# Altium project BUS.PrjPcb
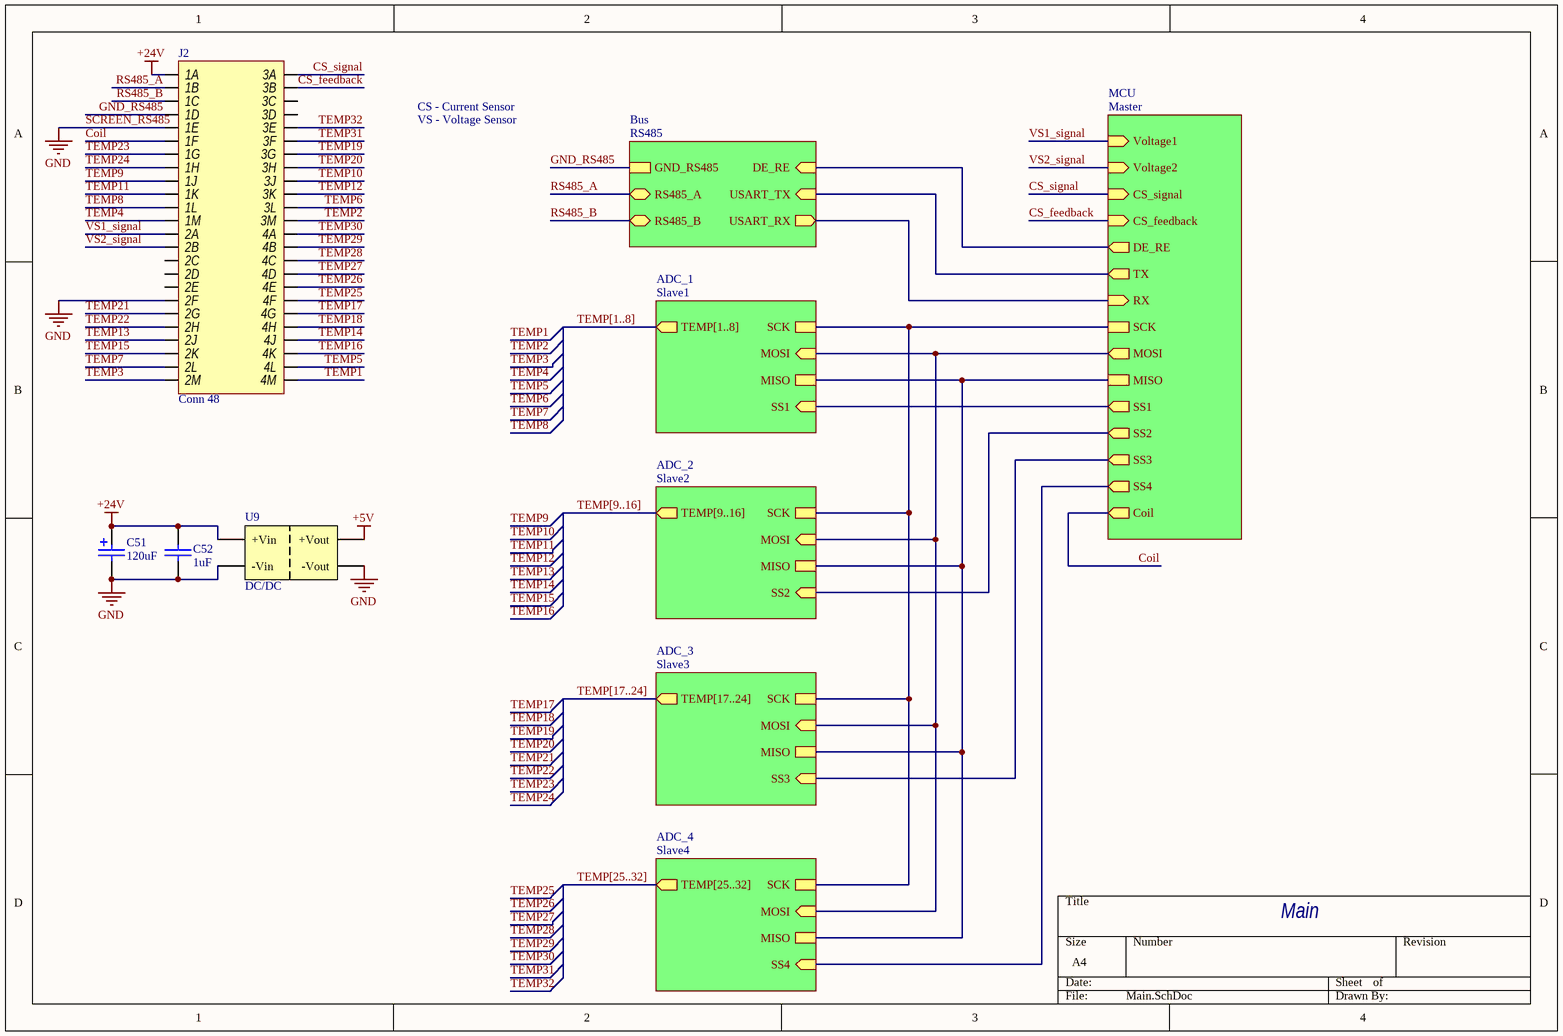
[diagram p0: Main.SchDoc]
7 sheets, 107 parts. Net scope: hierarchical (ports join the sheet entries above them; power ports are global).
Board file: BUS.PcbDoc
Sheets:
  Main.SchDoc
    MCU = Master.SchDoc
    ADC_2 = Slave2.SchDoc
    ADC_1 = Slave1.SchDoc
    ADC_4 = Slave4.SchDoc
    ADC_3 = Slave3.SchDoc
    Bus = RS485.SchDoc

## Sheet Main.SchDoc
size A4; SheetNumber: 1; SheetTotal: 7

### Parts
C51  120uF  [Bar Cap 8 mm]
C52  1uF  [0603 Capicator]
J2  Conn 48  [5007620481]
U9  DC/DC  [SIP7]

### Sub-sheets
ADC_1 = Slave1: TEMP[1..8] (out), MISO, SS1 (in), MOSI (in), SCK
ADC_2 = Slave2: TEMP[9..16] (out), MISO, SS2 (in), MOSI (in), SCK
ADC_3 = Slave3: TEMP[17..24] (out), MISO, SS3 (in), MOSI (in), SCK
ADC_4 = Slave4: TEMP[25..32] (out), MISO, SS4 (in), MOSI (in), SCK
Bus = RS485: USART_TX (in), USART_RX (out), RS485_A (bidir), RS485_B (bidir), DE_RE (in), GND_RS485
MCU = Master: MISO, SCK, SS1 (out), MOSI (out), SS2 (out), SS3 (out), SS4 (out), Coil (out), TX (out), RX (in), CS_feedback (in), CS_signal (in), DE_RE (out), Voltage2 (in), Voltage1 (in)

### Nets
+5V: U9.6(+Vout)
+24V: C51.2 C52.2 J2.1A U9.1(+Vin)
GND: C51.1 C52.1 J2.1E J2.2F U9.2(-Vin) U9.4(-Vout)
Coil: J2.1F ; sheet MCU/Coil
CS_feedback: J2.3B ; sheet MCU/CS_feedback
CS_signal: J2.3A ; sheet MCU/CS_signal
GND_RS485: J2.1D ; sheet Bus/GND_RS485
MISO: sheet MCU/MISO, sheet ADC_2/MISO, sheet ADC_1/MISO, sheet ADC_4/MISO, sheet ADC_3/MISO
MOSI: sheet MCU/MOSI, sheet ADC_2/MOSI, sheet ADC_1/MOSI, sheet ADC_4/MOSI, sheet ADC_3/MOSI
RS485_A: J2.1B ; sheet Bus/RS485_A
RS485_B: J2.1C ; sheet Bus/RS485_B
SCK: sheet MCU/SCK, sheet ADC_2/SCK, sheet ADC_1/SCK, sheet ADC_4/SCK, sheet ADC_3/SCK
TEMP1: J2.4M
TEMP2: J2.3M
TEMP3: J2.2M
TEMP4: J2.1M
TEMP5: J2.4L
TEMP6: J2.3L
TEMP7: J2.2L
TEMP8: J2.1L
TEMP9: J2.1J
TEMP10: J2.3J
TEMP11: J2.1K
TEMP12: J2.3K
TEMP13: J2.2J
TEMP14: J2.4J
TEMP15: J2.2K
TEMP16: J2.4K
TEMP17: J2.4G
TEMP18: J2.4H
TEMP19: J2.3G
TEMP20: J2.3H
TEMP21: J2.2G
TEMP22: J2.2H
TEMP23: J2.1G
TEMP24: J2.1H
TEMP25: J2.4F
TEMP26: J2.4E
TEMP27: J2.4D
TEMP28: J2.4C
TEMP29: J2.4B
TEMP30: J2.4A
TEMP31: J2.3F
TEMP32: J2.3E
VS1_signal: J2.2A ; sheet MCU/Voltage1
VS2_signal: J2.2B ; sheet MCU/Voltage2
NetU3_24: sheet MCU/SS4, sheet ADC_4/SS4
NetU3_25: sheet MCU/SS3, sheet ADC_3/SS3
NetU3_26: sheet MCU/SS2, sheet ADC_2/SS2
NetU3_27: sheet MCU/SS1, sheet ADC_1/SS1
NetU3_41: sheet MCU/DE_RE, sheet Bus/DE_RE
NetU3_42: sheet MCU/TX, sheet Bus/USART_TX
NetU3_43: sheet MCU/RX, sheet Bus/USART_RX

Not connected (* = marked no-connect by the designer): J2 2C 2D 2E 3C 3D

### Buses and harness runs
bus TEMP[1..8] = sheet ADC_1/TEMP[1..8]
bus TEMP[9..16] = sheet ADC_2/TEMP[9..16]
bus TEMP[17..24] = sheet ADC_3/TEMP[17..24]
bus TEMP[25..32] = sheet ADC_4/TEMP[25..32]

### Notes on the sheet
- CS - Current Sensor
- (near J2) SCREEN_RS485
- VS - Voltage Sensor
- Main

### Library data of the parts
C51 = Cap Pol 120uF: Polymer capacitor with low E.S.R. Rated voltage - 80V.; Manufacturer: Matsushita; PartNumber: EEU-FS1K121LB; Type: Capacitor; ComponentLink1Description: ChipDip; ComponentLink1URL: https://www.chipdip.ru/product0/8001968680
C52 = Cap 1uF (0603): 1uF X5R 25V 10% 0603; Manufacturer: Murata Manufacturing; Part Number: GRM188R61E105KAADD; Type: Capacitor; ComponentLink1Description: Chip&Dip; ComponentLink1URL: https://www.chipdip.ru/product/grm188r61e105k
J2 = Conn 48 (Molex): Molec 48 pin PCB Header 5007620481; Manufacturer: Molex; Type: Connector; Part Number: 5007620481; ComponentLink1Description: ChipDip; ComponentLink1URL: https://www.chipdip.ru/product0/8004298252; ComponentLink2Description: Promelec; ComponentLink2URL: https://www.promelec.ru/product/427663/; ComponentLink3Description: Datasheet; ComponentLink3URL: https://static.chipdip.ru/lib/148/DOC030148367.pdf
U9 = DC/DC Isolated 24V-5V [TMH]: The TMH series are ultra miniature, isolated 2 Watt DC/DC-converters in a Single-in-Line  package  (SIP); Manufacturer: Traco Power; Part Number: TMH2405S; ComponentLink1Description: Chip&Dip; ComponentLink1URL: https://www.chipdip.ru/product/tmh-2405s; ComponentLink2Description: DataSheet; ComponentLink2URL: https://static.chipdip.ru/lib/005/DOC001005854.pdf; Type: IC

## Sheet Master.SchDoc
size A4; SheetNumber: 2; SheetTotal: 7
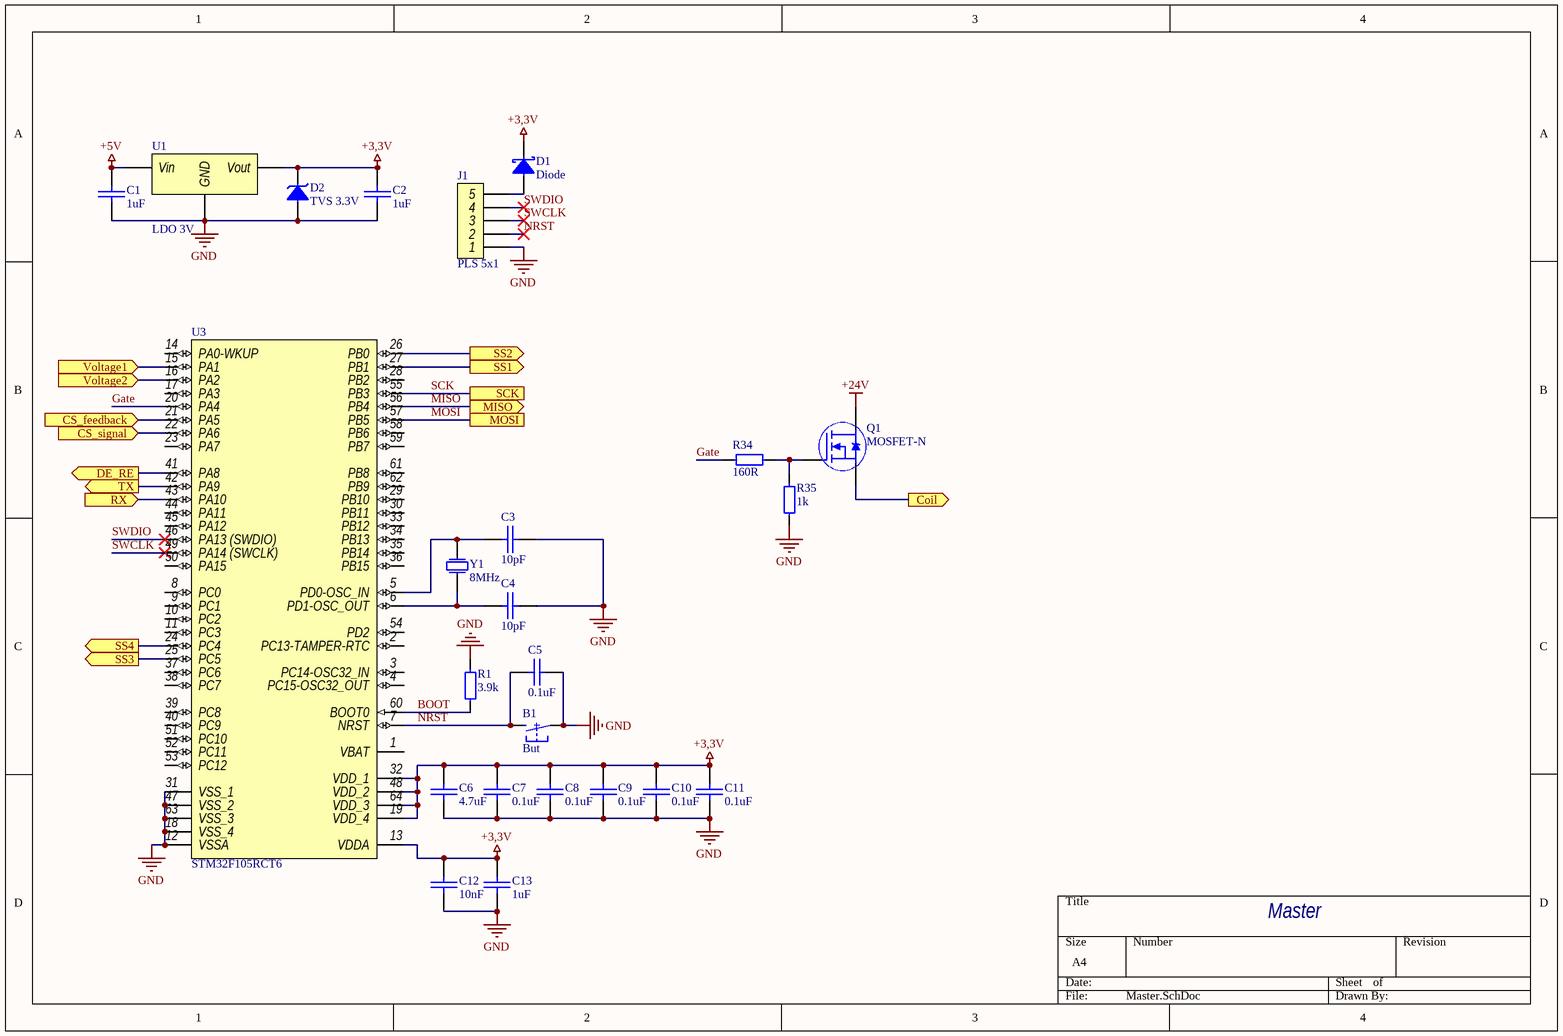
[diagram p1: Master.SchDoc]

### Parts
B1  But  [BUTTON 6x3.5]
C1  1uF  [0603 Capicator]
C2  1uF  [0603 Capicator]
C3  10pF  [0603 Capicator]
C4  10pF  [0603 Capicator]
C5  0.1uF  [0603 Capicator]
C6  4.7uF  [0603 Capicator]
C7  0.1uF  [0603 Capicator]
C8  0.1uF  [0603 Capicator]
C9  0.1uF  [0603 Capicator]
C10  0.1uF  [0603 Capicator]
C11  0.1uF  [0603 Capicator]
C12  10nF  [0603 Capicator]
C13  1uF  [0603 Capicator]
D1  Diode  [sod-123]
D2  TVS 3.3V  [DO-216AA]
J1  PLS 5x1  [PLS 5x1]
Q1  MOSFET-N  [SOT-23]
R1  3.9k  [0603 Resistor]
R34  160R  [0603 Resistor]
R35  1k  [0603 Resistor]
U1  LDO 3V  [SOT-23]
U3  STM32F105RCT6  [LQFP64]
Y1  8MHz  [NX5032GA]

### Ports
Coil (out), CS_feedback (in), CS_signal (in), DE_RE (out), MISO (out), MOSI, RX (in), SCK, SS1 (out), SS2 (out), SS3 (out), SS4 (out), TX (out), Voltage1 (in), Voltage2 (in)

### Nets
+3,3V: C2.2 C6.2 C7.2 C8.2 C9.2 C10.2 C11.2 C12.2 C13.2 D1.2 D2.2 U1.2(Vout) U3.13(VDDA) U3.19(VDD_4) U3.32(VDD_1) U3.48(VDD_2) U3.64(VDD_3)
+5V: C1.2 U1.3(Vin)
+24V: Q1.3(Drain)
GND: B1.1 C1.1 C2.1 C3.2 C4.2 C5.2 C6.1 C7.1 C8.1 C9.1 C10.1 C11.1 C12.1 C13.1 D2.1 J1.1 R1.2 R35.1 U1.1(GND) U3.12(VSSA) U3.18(VSS_4) U3.31(VSS_1) U3.47(VSS_2) U3.63(VSS_3)
BOOT: R1.1 U3.60(BOOT0)
Coil: Q1.2(Source) ; port Coil
CS_feedback: U3.21(PA5) ; port CS_feedback
CS_signal: U3.22(PA6) ; port CS_signal
Gate: R34.1 U3.20(PA4)
MISO: U3.56(PB4) ; port MISO
MOSI: U3.57(PB5) ; port MOSI
NRST: B1.2 C5.1 J1.2 U3.7(NRST)
SCK: U3.55(PB3) ; port SCK
SWCLK: J1.3 U3.49(PA14_(SWCLK))
SWDIO: J1.4 U3.46(PA13_(SWDIO))
VS1_signal: U3.15(PA1) ; port Voltage1
VS2_signal: U3.16(PA2) ; port Voltage2
NetC3_1: C3.1 U3.5(PD0-OSC_IN) Y1.2
NetC4_1: C4.1 U3.6(PD1-OSC_OUT) Y1.1
NetD1_1: D1.1 J1.5
NetQ1_1: Q1.1(Gate) R34.2 R35.2
NetU3_24: U3.24(PC4) ; port SS4
NetU3_25: U3.25(PC5) ; port SS3
NetU3_26: U3.26(PB0) ; port SS2
NetU3_27: U3.27(PB1) ; port SS1
NetU3_41: U3.41(PA8) ; port DE_RE
NetU3_42: U3.42(PA9) ; port TX
NetU3_43: U3.43(PA10) ; port RX

Not connected (* = marked no-connect by the designer): U3 1(VBAT) 2(PC13-TAMPER-RTC) 3(PC14-OSC32_IN) 4(PC15-OSC32_OUT) 8(PC0) 9(PC1) 10(PC2) 11(PC3) 14(PA0-WKUP) 17(PA3) 23(PA7) 28(PB2) 29(PB10) 30(PB11) 33(PB12) 34(PB13) 35(PB14) 36(PB15) 37(PC6) 38(PC7) 39(PC8) 40(PC9) 44(PA11) 45(PA12) 50(PA15) 51(PC10) 52(PC11) 53(PC12) 54(PD2) 58(PB6) 59(PB7) 61(PB8) 62(PB9)

### Notes on the sheet
- Master

### Library data of the parts
B1 = Button 2 Conn: Button 2 Conn SMD; Part Number: L-KLS7-TS3608-5.0-180; Manufacturer: KLS electronic co ltd; Type: Button; ComponentLink1Description: Chip&Dip; ComponentLink1URL: https://www.chipdip.ru/product/kls7-ts3608-5.0-180-td-02xa
C1 C2 C13 = Cap 1uF (0603): as C52 on sheet Main; ComponentLink1Description: Chip&Dip; ComponentLink1URL: https://www.chipdip.ru/product/grm188r61e105k
C3 C4 = Cap 10pF (0603): 10pF NP0 50V 5% 0603; Manufacturer: Murata Manufacturing; Part Number: GRM1885C1H100JA01D; Type: Capacitor; ComponentLink1Description: Chip&Dip; ComponentLink1URL: https://www.chipdip.ru/product/grm1885c1h100j
C5 C7-C11 = Cap 0.1uF (0603): 0.1uF X7R 16V 10% 0603; Manufacturer: Murata Manufacturing; Part Number: GRM188R71C104KA01D; Type: Capacitor; ComponentLink1Description: Chip&Dip; ComponentLink1URL: https://www.chipdip.ru/product/grm188r71c104ka01d
C6 = Cap 4.7uF (0603): 4.7uF X5R 25V 10% 0603; Manufacturer: Murata Manufacturing; Part Number: GRM188R61E475KE11D; Type: Capacitor; ComponentLink1Description: Chip&Dip; ComponentLink1URL: https://www.chipdip.ru/product0/9000348448
C12 = Cap 10nF (0603): 10nF X7R  100V 10% 0603; Manufacturer: Murata Manufacturing; Part Number: GRM188R72A103KA01D; Type: Capacitor; ComponentLink1Description: Chip&Dip; ComponentLink1URL: https://www.chipdip.ru/product/grm188r72a103ka01d
D1 = Diode Schottky (SOD-123): 0.5 A, Low Forward Voltage less than 385 mV, 400 mW Power Dissipation Package; Part Number: MBR0520L; Manufacturer: ON Semiconductor; Type: Diode; ComponentLink1Description: DataSheet; ComponentLink1URL: http://www.farnell.com/datasheets/1875336.pdf; ComponentLink2Description: Chip&Dip; ComponentLink2URL: https://www.chipdip.ru/product/mbr0520l
D2 = TVS Diode 3.3V [SM2T]: High peak pulse power: 200 W (10/1000 μs); Part Number: SM2T3V3A; Manufacturer: STMicroelectronics; Type: Diode; ComponentLink1Description: DataSheet; ComponentLink1URL: https://www.st.com/resource/en/datasheet/sm2t3v3a.pdf; ComponentLink2Description: Chip&Dip; ComponentLink2URL: https://www.chipdip.ru/product0/8283670575
J1 = Conn 5 (PLS): Header, 5-Pin
Q1 = MOSFET-N [IRLML]: VDS 30V,  VGS Max ± 20V, RDS 27-40mΩ,; Part Number: IRLML0030TRPBF; Manufacturer: Infineon Technologies; Type: Transistor; ComponentLink1Description: DataSheet; ComponentLink1URL: https://static.chipdip.ru/lib/300/DOC000300382.pdf; ComponentLink2Description: Chip&Dip; ComponentLink2URL: https://www.chipdip.ru/product/irlml0030trpbf
R1 = Res 3.9k (0603): 0.1W 0603 3.9k, 1%; Part Number: RC0603FR-073K9L; Manufacturer: Taiwan; Type: Resistor; ComponentLink1Description: Chip&Dip; ComponentLink1URL: https://www.chipdip.ru/product0/9000079726
R34 = Res 160R (0603): 0.1W 0603 160R, 1%; Part Number: RC0603FR-07160RL; Manufacturer: Taiwan; Type: Resistor; ComponentLink1Description: Chip&Dip; ComponentLink1URL: https://www.chipdip.ru/product/0.1w-0603-160-om-1
R35 = Res 1k (0603): 0.1W 0603 1k, 1%; Part Number: RC0603FR-071KL; Manufacturer: Taiwan; Type: Resistor; ComponentLink1Description: Chip&Dip; ComponentLink1URL: https://www.chipdip.ru/product0/9000079676
U1 = LDO 3,3V [MCP]: MCP1702 Low Dropout Voltage Regulator. The input operating range is specifiedfrom 2.7V to 13.2V; Part Number: MCP1702T-3002E/CB; Manufacturer: Microchip; ComponentLink1Description: DataSheet; ComponentLink1URL: https://static.chipdip.ru/lib/986/DOC003986671.pdf; ComponentLink2Description: Chip&Dip; ComponentLink2URL: https://www.chipdip.ru/product/mcp1702t-3002e-cb-microchip
U3 = STM32F105RCT6: MCU ARM 256KB FLASH MEM 64-LQFP; Manufacturer: STMicroelectronics; Part Number: STM32F105RCT6; ComponentLink1Description: DataSheet; ComponentLink1URL: https://static.chipdip.ru/lib/375/DOC011375072.pdf; ComponentLink2Description: Chip&Dip; ComponentLink2URL: https://www.chipdip.ru/product/stm32f105rct6; Type: IC
Y1 = Crystal 8MHz: Crystal NX5032GA; Manufacturer: Nihon Dempa Kogio (NDK); Part Number: NX5032GA-8MHz; Type: Crystal; ComponentLink1Description: Chip&Dip; ComponentLink1URL: https://www.chipdip.ru/product0/9000523954

## Sheet Slave2.SchDoc
size A4; SheetNumber: 5; SheetTotal: 7
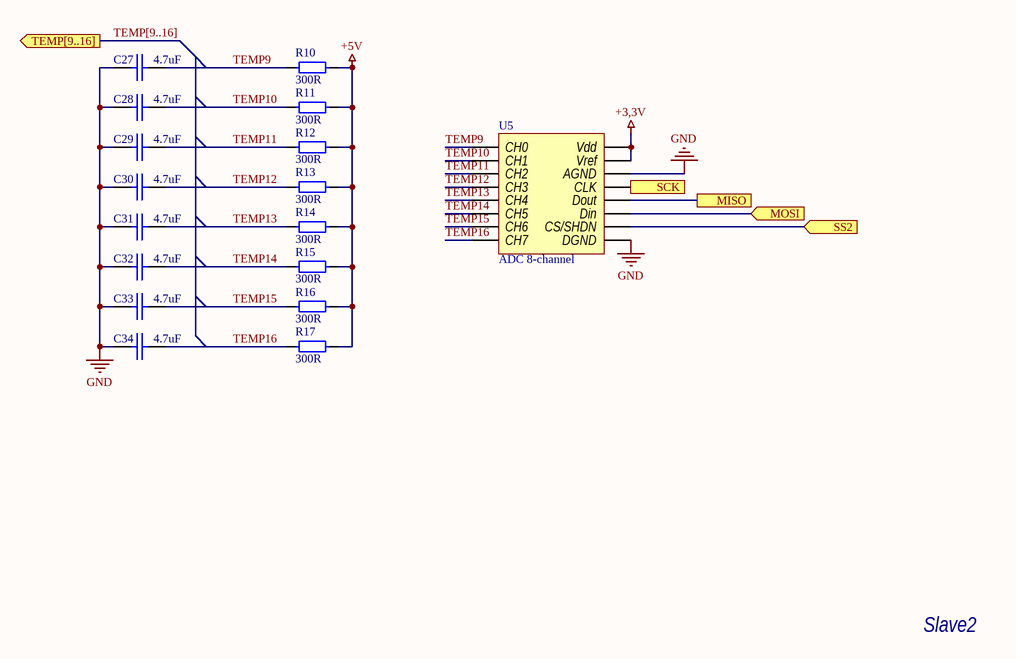
[diagram p2: Slave2.SchDoc]

### Parts
C27  4.7uF  [0603 Capicator]
C28  4.7uF  [0603 Capicator]
C29  4.7uF  [0603 Capicator]
C30  4.7uF  [0603 Capicator]
C31  4.7uF  [0603 Capicator]
C32  4.7uF  [0603 Capicator]
C33  4.7uF  [0603 Capicator]
C34  4.7uF  [0603 Capicator]
R10  300R  [0603 Resistor]
R11  300R  [0603 Resistor]
R12  300R  [0603 Resistor]
R13  300R  [0603 Resistor]
R14  300R  [0603 Resistor]
R15  300R  [0603 Resistor]
R16  300R  [0603 Resistor]
R17  300R  [0603 Resistor]
U5  ADC 8-channel  [SOIC-16]

### Ports
MISO, MOSI (in), SCK, SS2 (in), TEMP[9..16] (out)

### Nets
+3,3V: U5.15(Vref) U5.16(Vdd)
+5V: R10.2 R11.2 R12.2 R13.2 R14.2 R15.2 R16.2 R17.2
GND: C27.1 C28.1 C29.1 C30.1 C31.1 C32.1 C33.1 C34.1 U5.9(DGND) U5.14(AGND)
MISO: U5.12(Dout) ; port MISO
MOSI: U5.11(Din) ; port MOSI
SCK: U5.13(CLK) ; port SCK
TEMP9: C27.2 R10.1 U5.1(CH0)
TEMP10: C28.2 R11.1 U5.2(CH1)
TEMP11: C29.2 R12.1 U5.3(CH2)
TEMP12: C30.2 R13.1 U5.4(CH3)
TEMP13: C31.2 R14.1 U5.5(CH4)
TEMP14: C32.2 R15.1 U5.6(CH5)
TEMP15: C33.2 R16.1 U5.7(CH6)
TEMP16: C34.2 R17.1 U5.8(CH7)
NetU3_26: U5.10(CS/SHDN) ; port SS2

### Buses and harness runs
bus TEMP[9..16] = port TEMP[9..16]

### Notes on the sheet
- Slave2

### Library data of the parts
C27-C34 = Cap 4.7uF (0603): as C6 on sheet Master; ComponentLink1Description: Chip&Dip; ComponentLink1URL: https://www.chipdip.ru/product0/9000348448
R10-R17 = Res 300R (0603): 0.1W 0603 300R, 1%; Part Number: RC0603FR-07360RL; Manufacturer: Taiwan; Type: Resistor; ComponentLink1Description: Chip&Dip; ComponentLink1URL: https://www.chipdip.ru/product0/9000079629
U5 = MCP3008-I/SL: A/D converter with SPI serial interface; Manufacturer: Microchip; Part Number: MCP3008-I/SL; Type: IC; ComponentLink1Description: ChipDip; ComponentLink1URL: https://www.chipdip.ru/product/mcp3008-i-sl; ComponentLink2Description: Datadheet; ComponentLink2URL: https://static.chipdip.ru/lib/527/DOC011527685.pdf

## Sheet Slave1.SchDoc
size A4; SheetNumber: 4; SheetTotal: 7
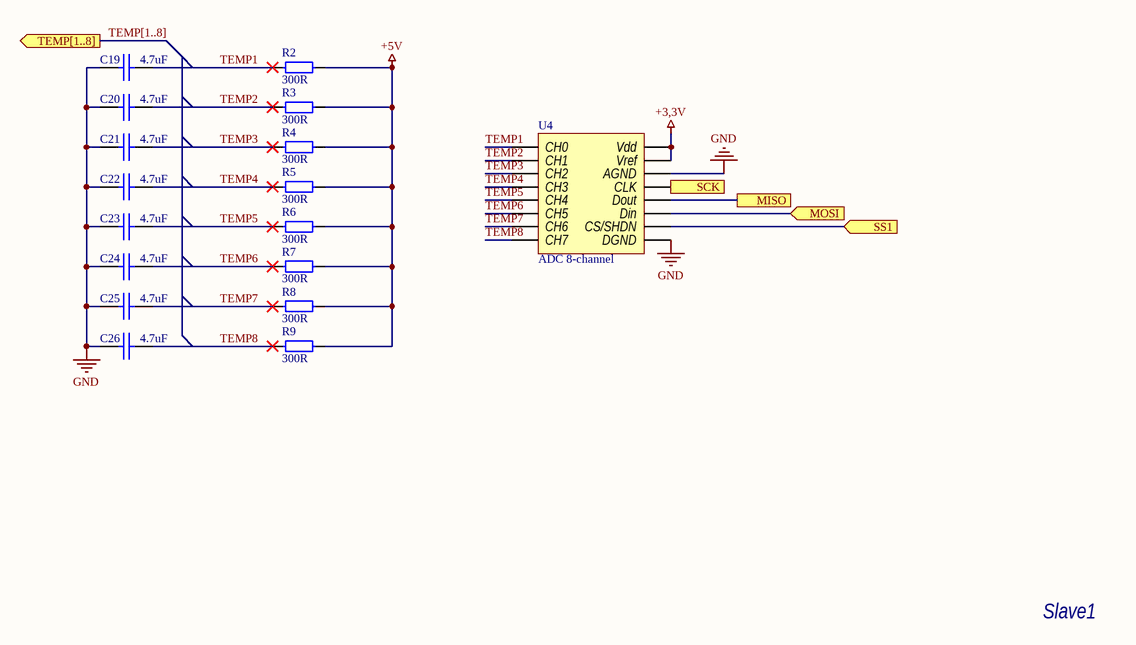
[diagram p3: Slave1.SchDoc]

### Parts
C19  4.7uF  [0603 Capicator]
C20  4.7uF  [0603 Capicator]
C21  4.7uF  [0603 Capicator]
C22  4.7uF  [0603 Capicator]
C23  4.7uF  [0603 Capicator]
C24  4.7uF  [0603 Capicator]
C25  4.7uF  [0603 Capicator]
C26  4.7uF  [0603 Capicator]
R2  300R  [0603 Resistor]
R3  300R  [0603 Resistor]
R4  300R  [0603 Resistor]
R5  300R  [0603 Resistor]
R6  300R  [0603 Resistor]
R7  300R  [0603 Resistor]
R8  300R  [0603 Resistor]
R9  300R  [0603 Resistor]
U4  ADC 8-channel  [SOIC-16]

### Ports
MISO, MOSI (in), SCK, SS1 (in), TEMP[1..8] (out)

### Nets
+3,3V: U4.15(Vref) U4.16(Vdd)
+5V: R2.2 R3.2 R4.2 R5.2 R6.2 R7.2 R8.2 R9.2
GND: C19.1 C20.1 C21.1 C22.1 C23.1 C24.1 C25.1 C26.1 U4.9(DGND) U4.14(AGND)
MISO: U4.12(Dout) ; port MISO
MOSI: U4.11(Din) ; port MOSI
SCK: U4.13(CLK) ; port SCK
TEMP1: C19.2 R2.1 U4.1(CH0)
TEMP2: C20.2 R3.1 U4.2(CH1)
TEMP3: C21.2 R4.1 U4.3(CH2)
TEMP4: C22.2 R5.1 U4.4(CH3)
TEMP5: C23.2 R6.1 U4.5(CH4)
TEMP6: C24.2 R7.1 U4.6(CH5)
TEMP7: C25.2 R8.1 U4.7(CH6)
TEMP8: C26.2 R9.1 U4.8(CH7)
NetU3_27: U4.10(CS/SHDN) ; port SS1

### Buses and harness runs
bus TEMP[1..8] = port TEMP[1..8]

### Notes on the sheet
- Slave1

### Library data of the parts
C19-C26 = Cap 4.7uF (0603): as C6 on sheet Master; ComponentLink1Description: Chip&Dip; ComponentLink1URL: https://www.chipdip.ru/product0/9000348448
R2-R9 = Res 300R (0603): as R10 on sheet Slave2; Type: Resistor; ComponentLink1Description: Chip&Dip; ComponentLink1URL: https://www.chipdip.ru/product0/9000079629
U4 = MCP3008-I/SL: as U5 on sheet Slave2; Part Number: MCP3008-I/SL; Type: IC; ComponentLink1Description: ChipDip; ComponentLink1URL: https://www.chipdip.ru/product/mcp3008-i-sl; ComponentLink2Description: Datadheet; ComponentLink2URL: https://static.chipdip.ru/lib/527/DOC011527685.pdf

## Sheet Slave4.SchDoc
size A4; SheetNumber: 7; SheetTotal: 7
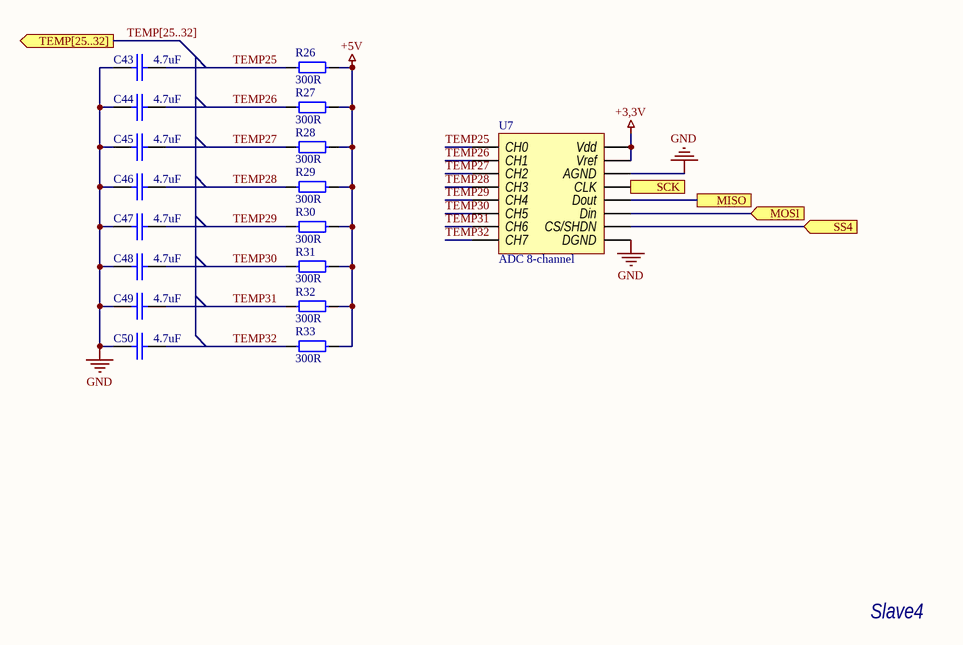
[diagram p4: Slave4.SchDoc]

### Parts
C43  4.7uF  [0603 Capicator]
C44  4.7uF  [0603 Capicator]
C45  4.7uF  [0603 Capicator]
C46  4.7uF  [0603 Capicator]
C47  4.7uF  [0603 Capicator]
C48  4.7uF  [0603 Capicator]
C49  4.7uF  [0603 Capicator]
C50  4.7uF  [0603 Capicator]
R26  300R  [0603 Resistor]
R27  300R  [0603 Resistor]
R28  300R  [0603 Resistor]
R29  300R  [0603 Resistor]
R30  300R  [0603 Resistor]
R31  300R  [0603 Resistor]
R32  300R  [0603 Resistor]
R33  300R  [0603 Resistor]
U7  ADC 8-channel  [SOIC-16]

### Ports
MISO, MOSI (in), SCK, SS4 (in), TEMP[25..32] (out)

### Nets
+3,3V: U7.15(Vref) U7.16(Vdd)
+5V: R26.2 R27.2 R28.2 R29.2 R30.2 R31.2 R32.2 R33.2
GND: C43.1 C44.1 C45.1 C46.1 C47.1 C48.1 C49.1 C50.1 U7.9(DGND) U7.14(AGND)
MISO: U7.12(Dout) ; port MISO
MOSI: U7.11(Din) ; port MOSI
SCK: U7.13(CLK) ; port SCK
TEMP25: C43.2 R26.1 U7.1(CH0)
TEMP26: C44.2 R27.1 U7.2(CH1)
TEMP27: C45.2 R28.1 U7.3(CH2)
TEMP28: C46.2 R29.1 U7.4(CH3)
TEMP29: C47.2 R30.1 U7.5(CH4)
TEMP30: C48.2 R31.1 U7.6(CH5)
TEMP31: C49.2 R32.1 U7.7(CH6)
TEMP32: C50.2 R33.1 U7.8(CH7)
NetU3_24: U7.10(CS/SHDN) ; port SS4

### Buses and harness runs
bus TEMP[25..32] = port TEMP[25..32]

### Notes on the sheet
- Slave4

### Library data of the parts
C43-C50 = Cap 4.7uF (0603): as C6 on sheet Master; ComponentLink1Description: Chip&Dip; ComponentLink1URL: https://www.chipdip.ru/product0/9000348448
R26-R33 = Res 300R (0603): as R10 on sheet Slave2; Type: Resistor; ComponentLink1Description: Chip&Dip; ComponentLink1URL: https://www.chipdip.ru/product0/9000079629
U7 = MCP3008-I/SL: as U5 on sheet Slave2; Part Number: MCP3008-I/SL; Type: IC; ComponentLink1Description: ChipDip; ComponentLink1URL: https://www.chipdip.ru/product/mcp3008-i-sl; ComponentLink2Description: Datadheet; ComponentLink2URL: https://static.chipdip.ru/lib/527/DOC011527685.pdf

## Sheet Slave3.SchDoc
size A4; SheetNumber: 6; SheetTotal: 7
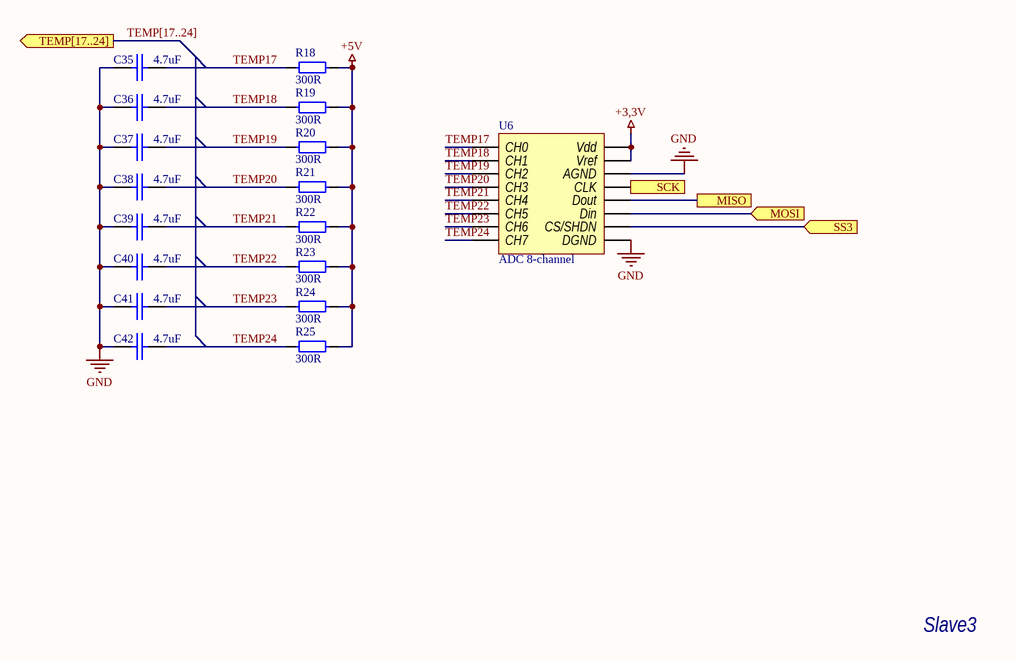
[diagram p5: Slave3.SchDoc]

### Parts
C35  4.7uF  [0603 Capicator]
C36  4.7uF  [0603 Capicator]
C37  4.7uF  [0603 Capicator]
C38  4.7uF  [0603 Capicator]
C39  4.7uF  [0603 Capicator]
C40  4.7uF  [0603 Capicator]
C41  4.7uF  [0603 Capicator]
C42  4.7uF  [0603 Capicator]
R18  300R  [0603 Resistor]
R19  300R  [0603 Resistor]
R20  300R  [0603 Resistor]
R21  300R  [0603 Resistor]
R22  300R  [0603 Resistor]
R23  300R  [0603 Resistor]
R24  300R  [0603 Resistor]
R25  300R  [0603 Resistor]
U6  ADC 8-channel  [SOIC-16]

### Ports
MISO, MOSI (in), SCK, SS3 (in), TEMP[17..24] (out)

### Nets
+3,3V: U6.15(Vref) U6.16(Vdd)
+5V: R18.2 R19.2 R20.2 R21.2 R22.2 R23.2 R24.2 R25.2
GND: C35.1 C36.1 C37.1 C38.1 C39.1 C40.1 C41.1 C42.1 U6.9(DGND) U6.14(AGND)
MISO: U6.12(Dout) ; port MISO
MOSI: U6.11(Din) ; port MOSI
SCK: U6.13(CLK) ; port SCK
TEMP17: C35.2 R18.1 U6.1(CH0)
TEMP18: C36.2 R19.1 U6.2(CH1)
TEMP19: C37.2 R20.1 U6.3(CH2)
TEMP20: C38.2 R21.1 U6.4(CH3)
TEMP21: C39.2 R22.1 U6.5(CH4)
TEMP22: C40.2 R23.1 U6.6(CH5)
TEMP23: C41.2 R24.1 U6.7(CH6)
TEMP24: C42.2 R25.1 U6.8(CH7)
NetU3_25: U6.10(CS/SHDN) ; port SS3

### Buses and harness runs
bus TEMP[17..24] = port TEMP[17..24]

### Notes on the sheet
- Slave3

### Library data of the parts
C35-C42 = Cap 4.7uF (0603): as C6 on sheet Master; ComponentLink1Description: Chip&Dip; ComponentLink1URL: https://www.chipdip.ru/product0/9000348448
R18-R25 = Res 300R (0603): as R10 on sheet Slave2; Type: Resistor; ComponentLink1Description: Chip&Dip; ComponentLink1URL: https://www.chipdip.ru/product0/9000079629
U6 = MCP3008-I/SL: as U5 on sheet Slave2; Part Number: MCP3008-I/SL; Type: IC; ComponentLink1Description: ChipDip; ComponentLink1URL: https://www.chipdip.ru/product/mcp3008-i-sl; ComponentLink2Description: Datadheet; ComponentLink2URL: https://static.chipdip.ru/lib/527/DOC011527685.pdf

## Sheet RS485.SchDoc
size A4; SheetNumber: 3; SheetTotal: 7
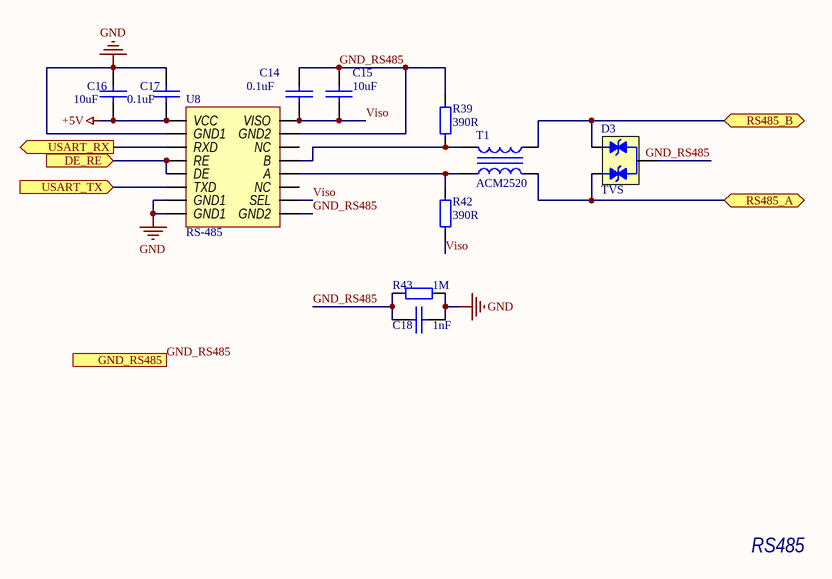
[diagram p6: RS485.SchDoc]

### Parts
C14  0.1uF  [0603 Capicator]
C15  10uF  [0603 Capicator]
C16  10uF  [0603 Capicator]
C17  0.1uF  [0603 Capicator]
C18  1nF  [0603 Capicator]
D3  TVS  [SOT-23]
R39  390R  [1206 RESISTOR]
R42  390R  [1206 RESISTOR]
R43  1M  [0603 Resistor]
T1  ACM2520  [ACM2520]
U8  RS-485  [SOIC16W]

### Ports
DE_RE (in), GND_RS485, RS485_A (bidir), RS485_B (bidir), USART_RX (out), USART_TX (in)

### Nets
+5V: C16.2 C17.1 U8.1(VCC)
GND: C16.1 C17.2 C18.2 R43.2 U8.2(GND1) U8.7(GND1) U8.8(GND1)
GND_RS485: C14.2 C15.2 C18.1 D3.3 R39.2 R43.1 U8.9(GND2) U8.15(GND2) ; port GND_RS485
RS485_A: D3.2 T1.3 ; port RS485_A
RS485_B: D3.1 T1.4 ; port RS485_B
Viso: C14.1 C15.1 R42.1 U8.10(SEL) U8.16(VISO)
NetR39_1: R39.1 T1.1 U8.13(B)
NetR42_2: R42.2 T1.2 U8.12(A)
NetU3_41: U8.4(RE) U8.5(DE) ; port DE_RE
NetU3_42: U8.6(TXD) ; port USART_TX
NetU3_43: U8.3(RXD) ; port USART_RX

Not connected (* = marked no-connect by the designer): U8 11(NC) 14(NC)

### Notes on the sheet
- RS485

### Library data of the parts
C14 C17 = Cap 0.1uF (0603): as C5 on sheet Master; ComponentLink1Description: Chip&Dip; ComponentLink1URL: https://www.chipdip.ru/product/grm188r71c104ka01d
C15 C16 = Cap 10uF (0603): 10uF X5R 25V 20% 0603; Manufacturer: Murata Manufacturing; Part Number: GRM188R61E106M; Type: Capacitor; ComponentLink1Description: Chip&Dip; ComponentLink1URL: https://www.chipdip.ru/product/grm188r61e106m
C18 = Cap 1nF (0603): X7R 1nF 100V 10% 0603; Manufacturer: Murata Manufacturing; Part Number: GRM188R72A102KA01D; Type: Capacitor; ComponentLink1Description: Chip&Dip; ComponentLink1URL: https://www.chipdip.ru/product/grm188r72a102ka01d
D3 = TVS Diode Arrays: The SM24CANB TVS Diode Array is designed to protect automotive Controller Area Network (CAN) lines from damage due to electrostatic discharge (ESD), electrical fast transient (EFT), and other overvoltage transients.; Part Number: SM24CANB-02HTG; Manufacturer: Littelfuse; Type: Diode; ComponentLink1Description: DataSheet; ComponentLink1URL: https://m.littelfuse.com/~/media/electronics/datasheets/tvs_diode_arrays/littelfuse_tvs_diode_array_sm24canb_datasheet.pdf.pdf; ComponentLink2Description: Chip&Dip; ComponentLink2URL: https://www.chipdip.ru/product1/8001779022
R39 R42 = Res 390R (1206): 0.25W 1206 390R; Part Number: RC1206JR-07390KL; Manufacturer: Taiwan; Type: Resistor; ComponentLink1Description: Chip&Dip; ComponentLink1URL: https://www.chipdip.ru/product0/8023504304
R43 = Res 1M (0603): 0.1W 0603 1M, 1%; Part Number: RC0603FR-071ML; Manufacturer: Taiwan; Type: Resistor; ComponentLink1Description: Chip&Dip; ComponentLink1URL: https://www.chipdip.ru/product0/9000079784
T1 = ACM2520: Common mode filters / Automotive signal line (for power train/safety); Manufacturer: TDK; Part Number: ACM2520-301-2P-T002; Type: Inductor; ComponentLink1Description: DataSheet; ComponentLink1URL: https://product.tdk.com/system/files/dam/doc/product/emc/emc/cmf_cmc/catalog/cmf_commercial_signal_acm2520_en.pdf; ComponentLink2Description: ChipDip; ComponentLink2URL: https://www.chipdip.ru/product0/8008480337?ysclid=lw4t4jsj9a923851487
U8 = TDA51S485HC: Isolated RS-485 Half-Duplex tranciever; Manufacturer: Mornsun; Type: IC; Part Number: TDA51S485HC; ComponentLink1Description: ChipDip; ComponentLink1URL: https://www.chipdip.ru/product0/8009281357; ComponentLink2Description: Datasheet; ComponentLink2URL: https://www.mornsun-power.com/html/pdf/TDA51S485HC.html

## Nets that join several sheets
+3,3V: Master (17 pins), Slave2 (U5.15 U5.16), Slave1 (U4.15 U4.16), Slave4 (U7.15 U7.16), Slave3 (U6.15 U6.16)
+5V: Main (U9.6), Master (C1.2 U1.3), Slave2 (8 pins), Slave1 (8 pins), Slave4 (8 pins), Slave3 (8 pins), RS485 (C16.2 C17.1 U8.1)
+24V: Main (C51.2 C52.2 J2.1A U9.1), Master (Q1.3)
GND: Main (6 pins), Master (24 pins), Slave2 (10 pins), Slave1 (10 pins), Slave4 (10 pins), Slave3 (10 pins), RS485 (7 pins)
Coil: Main (J2.1F), Master (Q1.2)
CS_feedback: Main (J2.3B), Master (U3.21)
CS_signal: Main (J2.3A), Master (U3.22)
GND_RS485: Main (J2.1D), RS485 (8 pins)
MISO: Master (U3.56), Slave2 (U5.12), Slave1 (U4.12), Slave4 (U7.12), Slave3 (U6.12)
MOSI: Master (U3.57), Slave2 (U5.11), Slave1 (U4.11), Slave4 (U7.11), Slave3 (U6.11)
NetU3_24: Master (U3.24), Slave4 (U7.10)
NetU3_25: Master (U3.25), Slave3 (U6.10)
NetU3_26: Master (U3.26), Slave2 (U5.10)
NetU3_27: Master (U3.27), Slave1 (U4.10)
NetU3_41: Master (U3.41), RS485 (U8.4 U8.5)
NetU3_42: Master (U3.42), RS485 (U8.6)
NetU3_43: Master (U3.43), RS485 (U8.3)
RS485_A: Main (J2.1B), RS485 (D3.2 T1.3)
RS485_B: Main (J2.1C), RS485 (D3.1 T1.4)
SCK: Master (U3.55), Slave2 (U5.13), Slave1 (U4.13), Slave4 (U7.13), Slave3 (U6.13)
TEMP1: Main (J2.4M), Slave1 (C19.2 R2.1 U4.1)
TEMP2: Main (J2.3M), Slave1 (C20.2 R3.1 U4.2)
TEMP3: Main (J2.2M), Slave1 (C21.2 R4.1 U4.3)
TEMP4: Main (J2.1M), Slave1 (C22.2 R5.1 U4.4)
TEMP5: Main (J2.4L), Slave1 (C23.2 R6.1 U4.5)
TEMP6: Main (J2.3L), Slave1 (C24.2 R7.1 U4.6)
TEMP7: Main (J2.2L), Slave1 (C25.2 R8.1 U4.7)
TEMP8: Main (J2.1L), Slave1 (C26.2 R9.1 U4.8)
TEMP9: Main (J2.1J), Slave2 (C27.2 R10.1 U5.1)
TEMP10: Main (J2.3J), Slave2 (C28.2 R11.1 U5.2)
TEMP11: Main (J2.1K), Slave2 (C29.2 R12.1 U5.3)
TEMP12: Main (J2.3K), Slave2 (C30.2 R13.1 U5.4)
TEMP13: Main (J2.2J), Slave2 (C31.2 R14.1 U5.5)
TEMP14: Main (J2.4J), Slave2 (C32.2 R15.1 U5.6)
TEMP15: Main (J2.2K), Slave2 (C33.2 R16.1 U5.7)
TEMP16: Main (J2.4K), Slave2 (C34.2 R17.1 U5.8)
TEMP17: Main (J2.4G), Slave3 (C35.2 R18.1 U6.1)
TEMP18: Main (J2.4H), Slave3 (C36.2 R19.1 U6.2)
TEMP19: Main (J2.3G), Slave3 (C37.2 R20.1 U6.3)
TEMP20: Main (J2.3H), Slave3 (C38.2 R21.1 U6.4)
TEMP21: Main (J2.2G), Slave3 (C39.2 R22.1 U6.5)
TEMP22: Main (J2.2H), Slave3 (C40.2 R23.1 U6.6)
TEMP23: Main (J2.1G), Slave3 (C41.2 R24.1 U6.7)
TEMP24: Main (J2.1H), Slave3 (C42.2 R25.1 U6.8)
TEMP25: Main (J2.4F), Slave4 (C43.2 R26.1 U7.1)
TEMP26: Main (J2.4E), Slave4 (C44.2 R27.1 U7.2)
TEMP27: Main (J2.4D), Slave4 (C45.2 R28.1 U7.3)
TEMP28: Main (J2.4C), Slave4 (C46.2 R29.1 U7.4)
TEMP29: Main (J2.4B), Slave4 (C47.2 R30.1 U7.5)
TEMP30: Main (J2.4A), Slave4 (C48.2 R31.1 U7.6)
TEMP31: Main (J2.3F), Slave4 (C49.2 R32.1 U7.7)
TEMP32: Main (J2.3E), Slave4 (C50.2 R33.1 U7.8)
VS1_signal: Main (J2.2A), Master (U3.15)
VS2_signal: Main (J2.2B), Master (U3.16)